# EAGLE design powerSwitch010 (EAGLE 5.12)

## Sheet 1 of 2
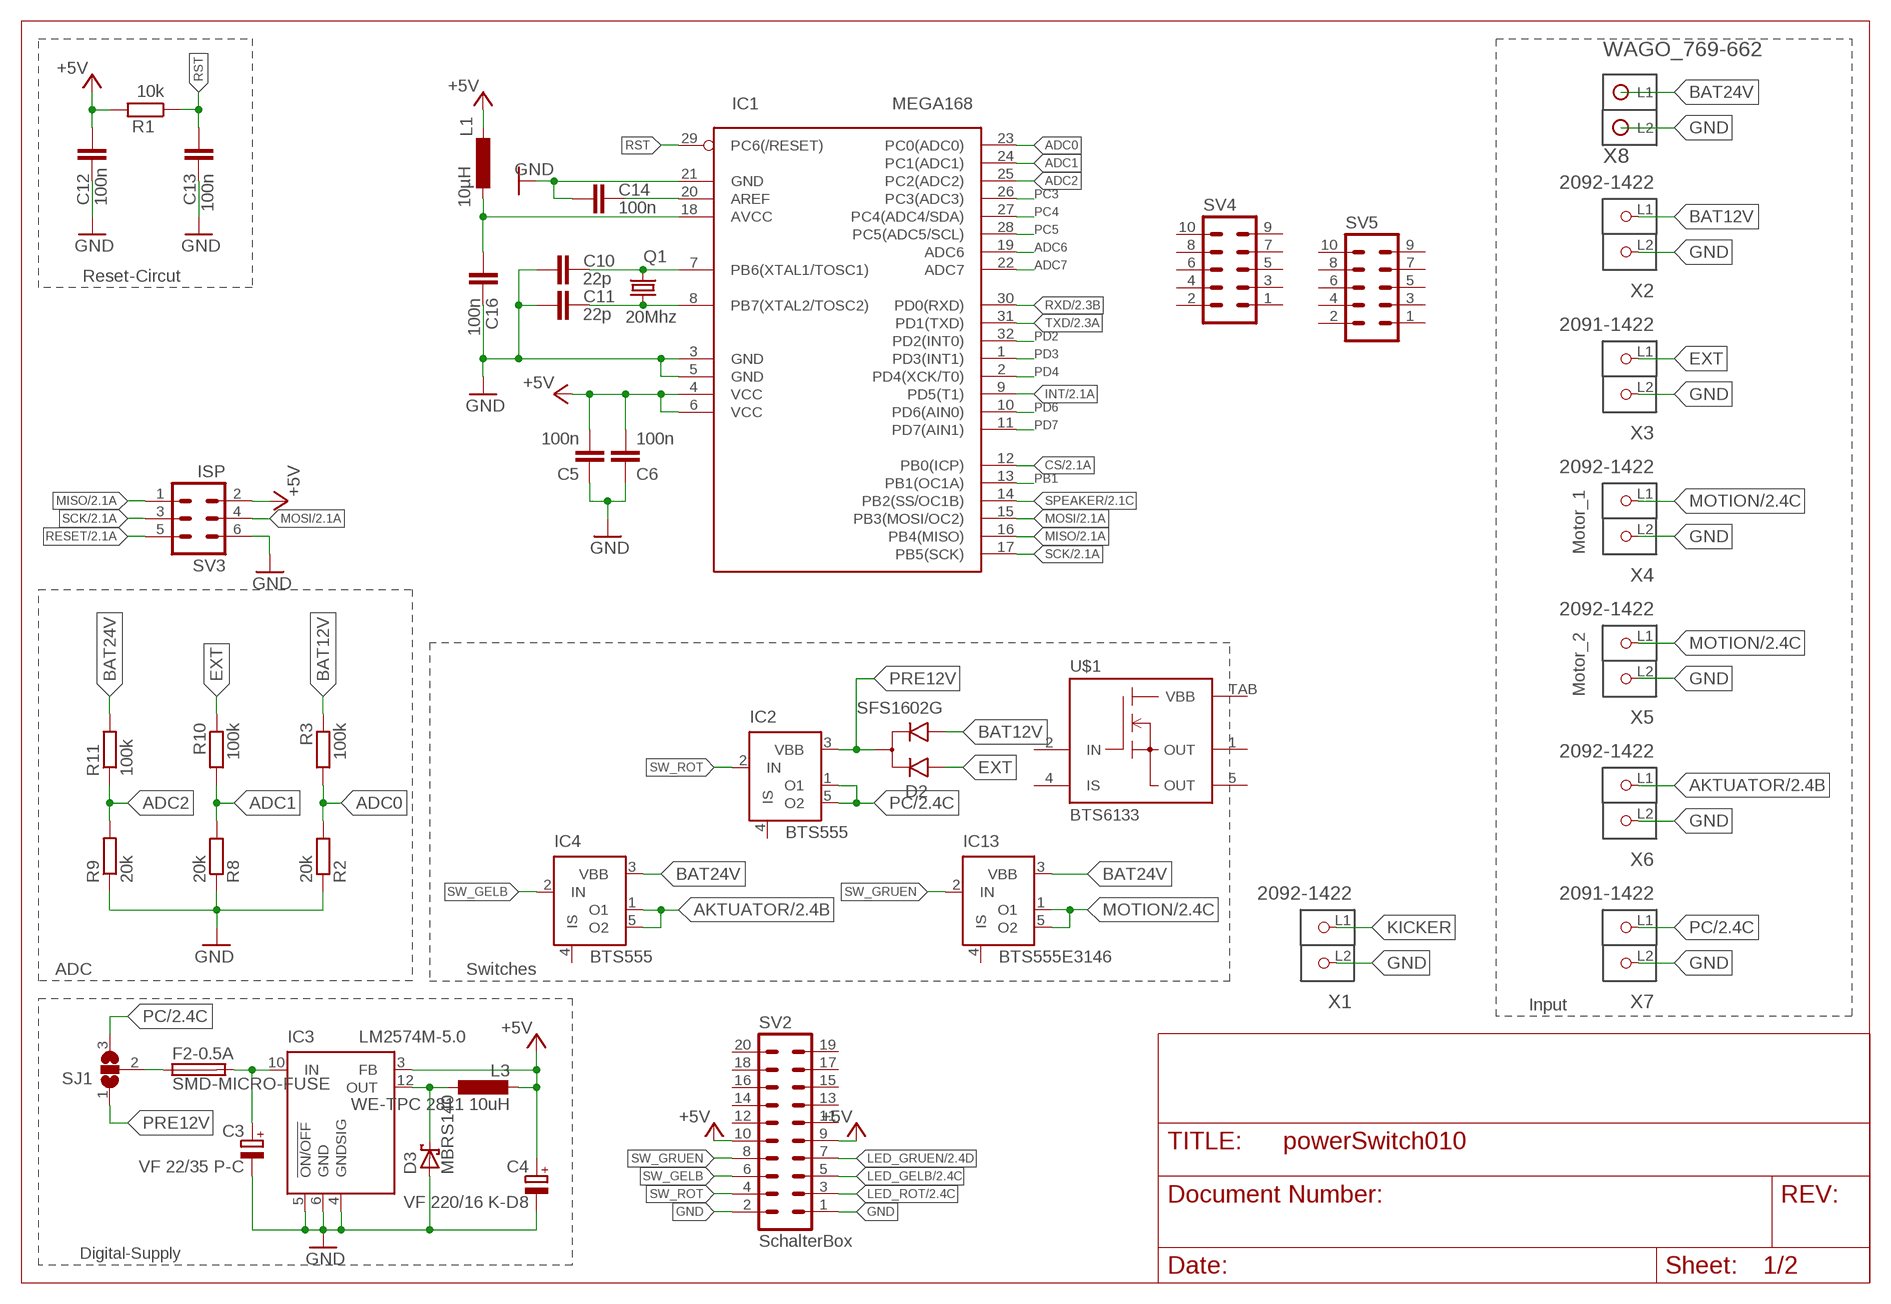
[diagram p0: schematic, sheet 1]

### Parts
C3  VF 22/35 P-C  CPOL-EUC  [PANASONIC_C]
C4  VF 220/16 K-D8  CPOL-EUD  [PANASONIC_D]
C5  100n  C-EUC0603K  [C0603K]
C6  100n  C-EUC0603K  [C0603K]
C10  22p  C-EUC0603K  [C0603K]
C11  22p  C-EUC0603K  [C0603K]
C12  100n  C-EUC0603K  [C0603K]
C13  100n  C-EUC0603K  [C0603K]
C14  100n  C-EUC0603K  [C0603K]
C16  100n  C-EUC0603K  [C0603K]
D2  SFS1602G  SFS160G  [D2PAK]
D3  MBRS140  SCHOTTKY-DIODESMD  [SMB]
F2-0.5A  SMD-MICRO-FUSE  [SMD-6,1X2,6]
IC1  MEGA168  MEGA8-AI  [TQFP32-08]
IC2  BTS555  [TO220-51]
IC3  LM2574M-5.0  [SO14W]
IC4  BTS555  [TO220-51]
IC13  BTS555E3146  [TO220-52]
L1  10µH  L-EU-0805L0805  [R0805]
L3  WE-TPC 2811 10uH  L-EUWE-TPC  [POWER-CHOKE_WE-TPC]
Q1  20Mhz  CRYTALHC49U-V  [HC49U-V@1]
R1  10k  R-EU_R0805  [R0805]
R2  20k  R-EU_R0805  [R0805]
R3  100k  R-EU_R0805  [R0805]
R8  20k  R-EU_R0805  [R0805]
R9  20k  R-EU_R0805  [R0805]
R10  100k  R-EU_R0805  [R0805]
R11  100k  R-EU_R0805  [R0805]
SJ1  SJ2W  [SJ_2]
SV2  SchalterBox  ML20  [ML20]
SV3  ISP  ML6  [ML6]
SV4  ML10  [ML10]
SV5  ML10  [ML10]
U$1  BTS6133  [TO252-51]
X1  2092-1422  [P-2092-1422]
X2  2092-1422  [P-2092-1422]
X3  2091-1422  [P-2091-1422]
X4  2092-1422  [P-2092-1422]
X5  2092-1422  [P-2092-1422]
X6  2092-1422  [P-2092-1422]
X7  2091-1422  [P-2091-1422]
X8  WAGO_769-662  [WAGO_769-662]

### Nets
+5V: C4.+ C5.2 C6.2 C12.2 IC1.4(VCC) IC1.6(VCC) IC3.3(FB) L1.2 L3.2 R1.2 SV2.9 SV2.10 SV3.2 ; also sheet 2
ADC0: IC1.23(PC0(ADC0)) R2.2 R3.2
ADC1: IC1.24(PC1(ADC1)) R8.2 R10.2
ADC2: IC1.25(PC2(ADC2)) R9.2 R11.1
ADC6: IC1.19(ADC6)
ADC7: IC1.22(ADC7)
AKTUATOR: IC4.1(O1) IC4.5(O2) X6.L1(P1) ; also sheet 2
BAT12V: D2.P$2 R3.1 X2.L1(P1)
BAT24V: IC4.3(VBB) IC13.3(VBB) R11.2 X8.P$1(L1)
CS: IC1.12(PB0(ICP)) ; also sheet 2
EXT: D2.P$1 R10.1 X3.L1(P1)
GND: C3.- C4.- C5.1 C6.1 C10.1 C11.1 C12.1 C13.1 C14.1 C16.2 D3.A IC1.3(GND) IC1.5(GND) IC1.21(GND) IC3.4(GNDSIG) IC3.5(!ON/OFF) IC3.6(GND) R2.1 R8.1 R9.1 SV2.1 SV2.2 SV3.6 X1.L2(P2) X2.L2(P2) X3.L2(P2) X4.L2(P2) X5.L2(P2) X6.L2(P2) X7.L2(P2) X8.P$2(L2) ; also sheet 2
INT: IC1.9(PD5(T1)) ; also sheet 2
KICKER: X1.L1(P1)
LED_GELB: SV2.5 ; also sheet 2
LED_GRUEN: SV2.7 ; also sheet 2
LED_ROT: SV2.3 ; also sheet 2
MISO: IC1.16(PB4(MISO)) SV3.1 ; also sheet 2
MOSI: IC1.15(PB3(MOSI/OC2)) SV3.4 ; also sheet 2
MOTION: IC13.1(O1) IC13.5(O2) X4.L1(P1) X5.L1(P1) ; also sheet 2
N$10: C10.2 IC1.7(PB6(XTAL1/TOSC1)) Q1.2
N$11: C11.2 IC1.8(PB7(XTAL2/TOSC2)) Q1.1
N$13: C14.2 IC1.20(AREF)
N$14: C16.1 IC1.18(AVCC) L1.1
N$22: C3.+ F2-0.5A.2 IC3.10(IN)
N$63: F2-0.5A.1 SJ1.2
N$64: D3.C IC3.12(OUT) L3.1
PB1: IC1.13(PB1(OC1A))
PC: IC2.1(O1) IC2.5(O2) SJ1.3 X7.L1(P1) ; also sheet 2
PC3: IC1.26(PC3(ADC3))
PC4: IC1.27(PC4(ADC4/SDA))
PC5: IC1.28(PC5(ADC5/SCL))
PD2: IC1.32(PD2(INT0))
PD3: IC1.1(PD3(INT1))
PD4: IC1.2(PD4(XCK/T0))
PD6: IC1.10(PD6(AIN0))
PD7: IC1.11(PD7(AIN1))
PRE12V: D2.P$3 IC2.3(VBB) SJ1.1
RESET: SV3.5 ; also sheet 2
RST: C13.2 IC1.29(PC6(/RESET)) R1.1
RXD: IC1.30(PD0(RXD)) ; also sheet 2
SCK: IC1.17(PB5(SCK)) SV3.3 ; also sheet 2
SPEAKER: IC1.14(PB2(SS/OC1B)) ; also sheet 2
SW_GELB: IC4.2(IN) SV2.6
SW_GRUEN: IC13.2(IN) SV2.8
SW_ROT: IC2.2(IN) SV2.4
TXD: IC1.31(PD1(TXD)) ; also sheet 2
Unconnected: IC2.4(IS) IC4.4(IS) IC13.4(IS) SV2.11 SV2.12 SV2.13 SV2.14 SV2.15 SV2.16 SV2.17 SV2.18 SV2.19 SV2.20 SV4.1 SV4.2 SV4.3 SV4.4 SV4.5 SV4.6 SV4.7 SV4.8 SV4.9 SV4.10 SV5.1 SV5.2 SV5.3 SV5.4 SV5.5 SV5.6 SV5.7 SV5.8 SV5.9 SV5.10 U$1.1(OUT) U$1.2(IN) U$1.4(IS) U$1.5(OUT)

### Notes on the sheet
- Reset-Circut
- Motor_1
- Motor_2
- ADC | Switches
- Input
- Digital-Supply

## Sheet 2 of 2
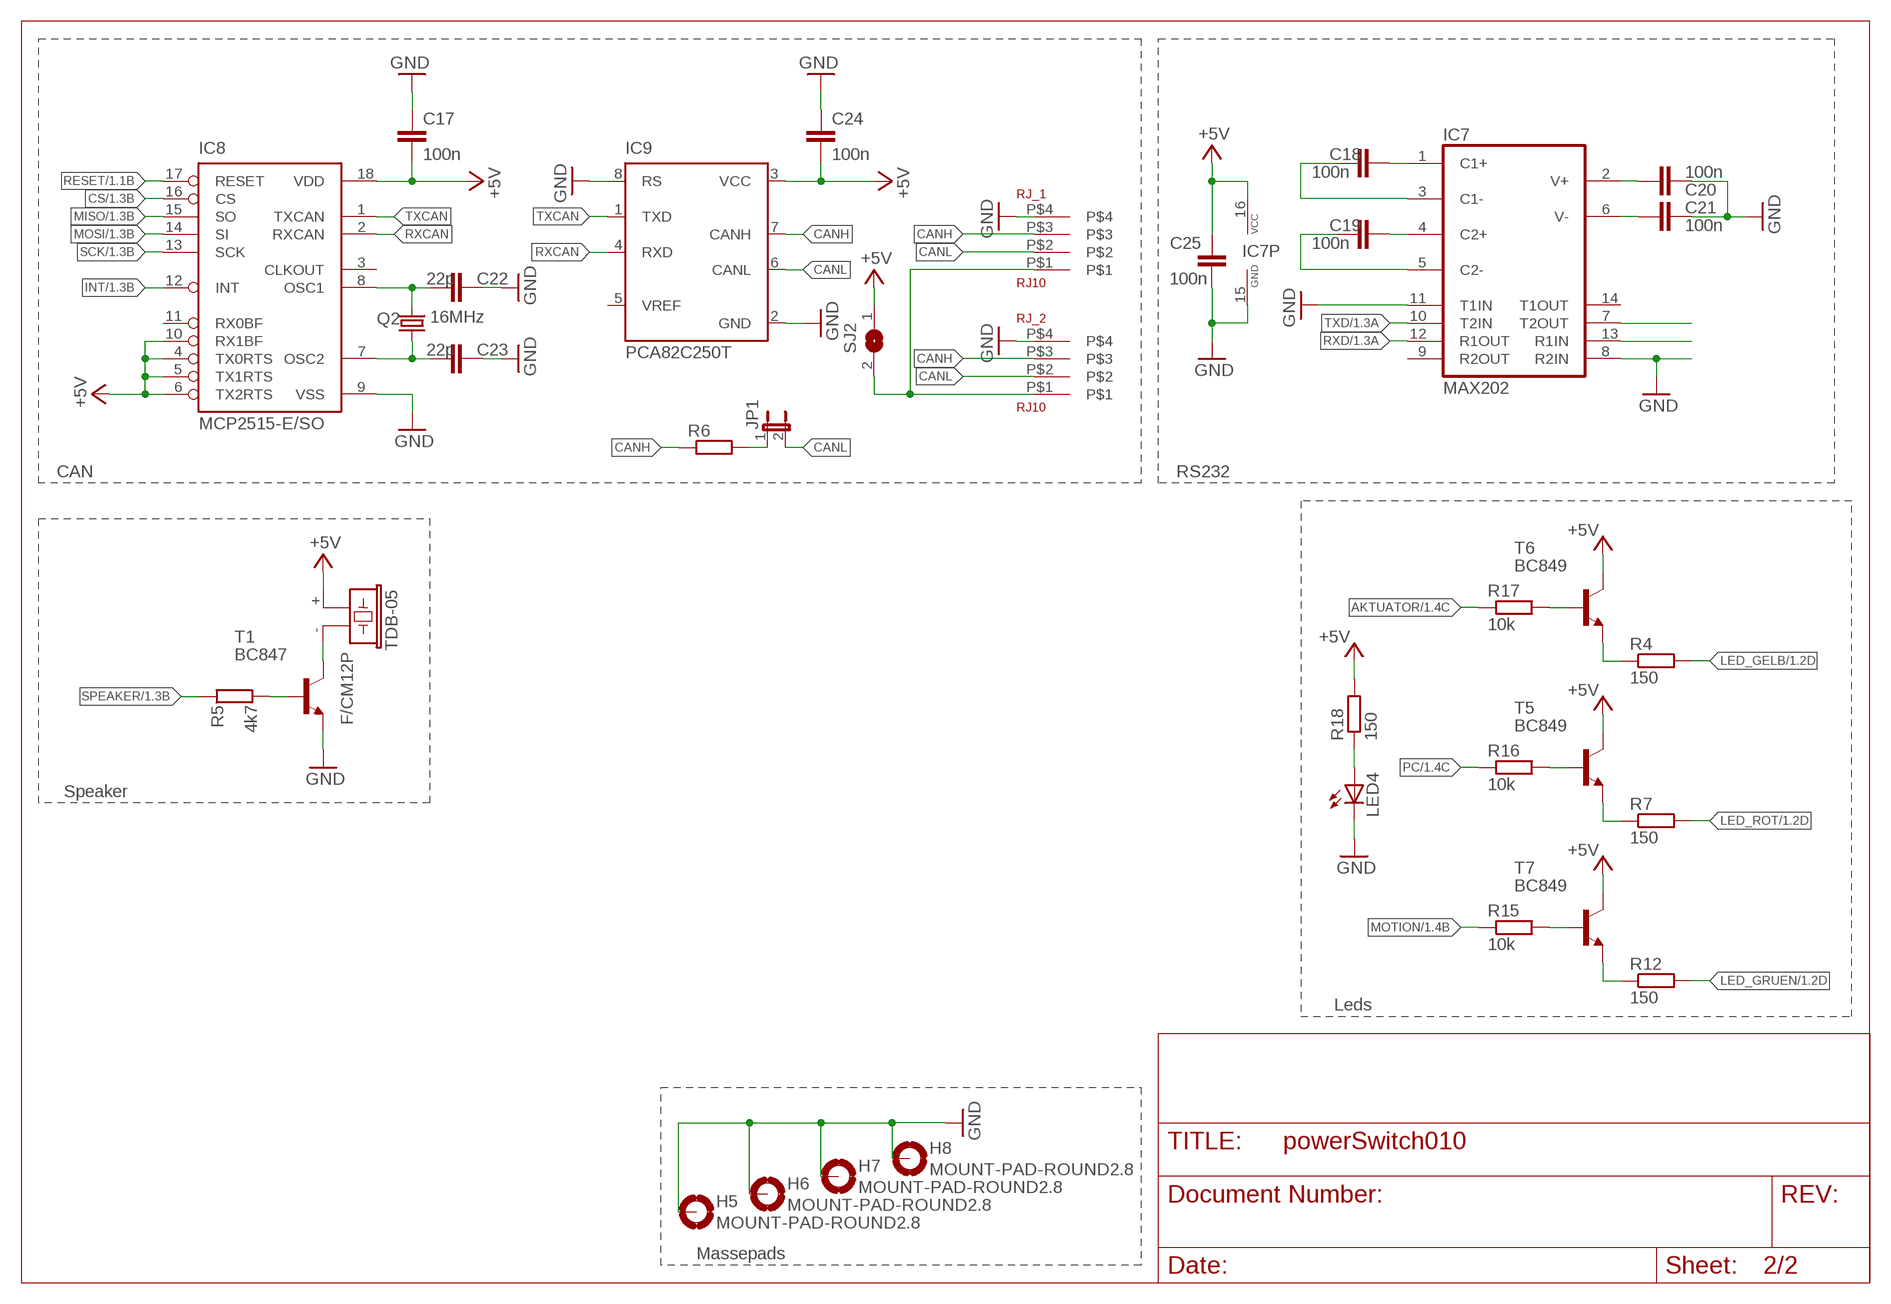
[diagram p1: schematic, sheet 2]

### Parts
C17  100n  C-EUC0603  [C0603]
C18  100n  C-EUC0603K  [C0603K]
C19  100n  C-EUC0603K  [C0603K]
C20  100n  C-EUC0603K  [C0603K]
C21  100n  C-EUC0603K  [C0603K]
C22  22p  C-EUC0603  [C0603]
C23  22p  C-EUC0603  [C0603]
C24  100n  C-EUC0603  [C0603]
C25  100n  C-EUC0603K  [C0603K]
H5  MOUNT-PAD-ROUND2.8  [2,8-PAD]
H6  MOUNT-PAD-ROUND2.8  [2,8-PAD]
H7  MOUNT-PAD-ROUND2.8  [2,8-PAD]
H8  MOUNT-PAD-ROUND2.8  [2,8-PAD]
IC7  MAX202  MAX3232CSE  [SO16]
IC8  MCP2515-E/SO  [SO18L]
IC9  PCA82C250T  [SO8]
JP1  JP1E  [JP1]
LED4  LEDCHIPLED_0805  [CHIPLED_0805]
Q2  16MHz  CRYSTALHC49U-V  [HC49U-V]
R4  150  R-EU_R0805  [R0805]
R5  4k7  R-EU_R0805  [R0805]
R6  R-EU_M0805  [M0805]
R7  150  R-EU_R0805  [R0805]
R12  150  R-EU_R0805  [R0805]
R15  10k  R-EU_R0805  [R0805]
R16  10k  R-EU_R0805  [R0805]
R17  10k  R-EU_R0805  [R0805]
R18  150  R-EU_R0805  [R0805]
RJ_1  RJ10  [RJ10]
RJ_2  RJ10  [RJ10]
SJ2  SJ  [SJ]
T1  BC847  [SOT23]
T5  BC849  [SOT23]
T6  BC849  [SOT23]
T7  BC849  [SOT23]
TDB-05  F/CM12P  [F/CM12P]

### Nets
+5V: C17.2 C24.2 C25.1 IC7.16(VCC) IC8.4(TX0RTS) IC8.5(TX1RTS) IC8.6(TX2RTS) IC8.10(RX1BF) IC8.18(VDD) IC9.3(VCC) R18.2 SJ2.1 T5.3(C) T6.3(C) T7.3(C) TDB-05.+ ; also sheet 1
AKTUATOR: R17.1 ; also sheet 1
CANH: IC9.7(CANH) R6.1 RJ_1.P$3 RJ_2.P$3
CANL: IC9.6(CANL) JP1.2 RJ_1.P$2 RJ_2.P$2
CS: IC8.16(CS) ; also sheet 1
GND: C17.1 C20.2 C21.2 C22.2 C23.2 C24.1 C25.2 H5.B2,8(MOUNT) H6.B2,8(MOUNT) H7.B2,8(MOUNT) H8.B2,8(MOUNT) IC7.8(R2IN) IC7.11(T1IN) IC7.15(GND) IC8.9(VSS) IC9.2(GND) IC9.8(RS) LED4.C RJ_1.P$4 RJ_2.P$4 T1.2(E) ; also sheet 1
INT: IC8.12(INT) ; also sheet 1
LED_GELB: R4.2 ; also sheet 1
LED_GRUEN: R12.2 ; also sheet 1
LED_ROT: R7.2 ; also sheet 1
MISO: IC8.15(SO) ; also sheet 1
MOSI: IC8.14(SI) ; also sheet 1
MOTION: R15.1 ; also sheet 1
N$1: R5.2 T1.1(B)
N$2: RJ_1.P$1 RJ_2.P$1 SJ2.2
N$4: R7.1 T5.2(E)
N$5: R4.1 T6.2(E)
N$6: R12.1 T7.2(E)
N$7: JP1.1 R6.2
N$15: C18.2 IC7.1(C1+)
N$18: C19.2 IC7.4(C2+)
N$20: T1.3(C) TDB-05.-
N$32: C22.1 IC8.8(OSC1) Q2.2
N$34: C23.1 IC8.7(OSC2) Q2.1
N$35: C18.1 IC7.3(C1-)
N$36: C19.1 IC7.5(C2-)
N$37: C20.1 IC7.2(V+)
N$38: C21.1 IC7.6(V-)
N$40: IC7.13(R1IN)
N$41: IC7.7(T2OUT)
N$102: R16.2 T5.1(B)
N$104: R17.2 T6.1(B)
N$106: R15.2 T7.1(B)
N$108: LED4.A R18.1
PC: R16.1 ; also sheet 1
RESET: IC8.17(RESET) ; also sheet 1
RXCAN: IC8.2(RXCAN) IC9.4(RXD)
RXD: IC7.12(R1OUT) ; also sheet 1
SCK: IC8.13(SCK) ; also sheet 1
SPEAKER: R5.1 ; also sheet 1
TXCAN: IC8.1(TXCAN) IC9.1(TXD)
TXD: IC7.10(T2IN) ; also sheet 1
Unconnected: IC7.9(R2OUT) IC7.14(T1OUT) IC8.3(CLKOUT) IC8.11(RX0BF) IC9.5(VREF)

### Notes on the sheet
- CAN | RS232
- Speaker
- Leds
- Massepads

## Power pins joined to a net without a drawn wire
VBB: U$1.TAB(VBB)

## Library data of the parts
C3 C4 = rcl:CPOL-EU: POLARIZED CAPACITOR, European symbol
C5 C6 C10-C14 C16-C25 = rcl:C-EU: CAPACITOR, European symbol
D2 = ownParts:SFS160*G
D3 = diode:SCHOTTKY-DIODE: Schottky Diode
F2-0.5A = f-lf-omniblok-s:SMD-MICRO-FUSE
H5-H8 = holes:MOUNT-PAD-ROUND: MOUNTING PAD, round
IC1 = atmel:MEGA8: MICROCONTROLLER 8 Kbytes FLASH, 1 kbytes SRAM, 512 bytes EEPROM, USART, 6-channel 10 bit ADC, 2-channel 8 bit ADC Pin compatible with Atmega48, ATMega88, ATMega168 Source: avr.lbr; MPN: ATMEGA8-16AU; OC_FARNELL: 9171371; OC_NEWARK: 73M8863
IC2 IC4 = infineon:BTS555: PROFET® Data Sheet BTS555 Source: http://www.infineon.com/upload/Document/cmc_upload/documents/011/8726/Datasheet_BTS555.pdf; MF: FARNELL; MPN: BTS555.; OC_FARNELL: 4109260; OC_NEWARK: 26H6766
IC3 = linear:LM2574?-*: SIMPLE SWITCHER 0.5A Step-Down Voltage Regulator Source: http://cache.national.com/ds/LM/LM2574.pdf
IC7 = maxim:MAX3232*: True RS-232 Transceivers 3.0V to 5.5V, Low-Power up to 1Mbps, Using Four 0.1µF External Capacitors Source: http://pdfserv.maxim-ic.com/en/ds/MAX3222-MAX3241.pdf; MPN: MAX3232CSE; OC_FARNELL: 9725490; OC_NEWARK: 90C2890
IC8 = mcp2515:MCP2515
IC9 = micro-philips:PCA82C250: CAN CONTROLLER INTERFACE; OC_FARNELL: 1085275; OC_NEWARK: unknown
IC13 = infineon:BTS555: PROFET® Data Sheet BTS555 Source: http://www.infineon.com/upload/Document/cmc_upload/documents/011/8726/Datasheet_BTS555.pdf; OC_FARNELL: unknown; OC_NEWARK: unknown
JP1 = jumper:JP1E: JUMPER
L1 = myrcl:L-EU-0805
L3 = rcl:L-EU: INDUCTOR, European symbol
LED4 = led:LED: LED OSRAM: - CHIPLED LG R971, LG N971, LY N971, LG Q971, LY Q971, LO R971, LY R971 LH N974, LH R974 LS Q976, LO Q976, LY Q976 LO Q996 - Hyper CHIPLED LW Q18S LB Q993, LB Q99A, LB R99A - SideLED LS A670, LO A670, LY A670, LG A670, LP A670 LB A673, LV A673, LT A673, LW A673 LH A674 LY A675 LS A676, LA A676, LO A676, LY A676, LW A676 LS A679, LY A679, LG A679 - Hyper Micro SIDELED® LS Y876, LA Y876, LO Y876, LY Y876 LT Y87S - SmartLED LW L88C, LW L88S LB L89C, LB L89S, LG L890 LS L89K, LO L89K, LY L89K LS L896, LA L896, LO L896, LY L896 - TOPLED LS T670, LO T670, LY T670, LG T670, LP T670 LSG T670, LSP T670, LSY T670, LOP T670, LYG T670 LG T671, LOG T671, LSG T671 LB T673, LV T673, LT T673, LW T673 LH T674 LS T676, LA T676, LO T676, LY T676, LB T676, LH T676, LSB T676, LW T676 LB T67C, LV T67C, LT T67C, LS T67K, LO T67K, LY T67K, LW E67C LS E67B, LA E67B, LO E67B, LY E67B, LB E67C, LV E67C, LT E67C LW T67C LS T679, LY T679, LG T679 LS T770, LO T770, LY T770, LG T770, LP T770 LB T773, LV T773, LT T773, LW T773 LH T774 LS E675, LA E675, LY E675, LS T675 LS T776, LA T776, LO T776, LY T776, LB T776 LHGB T686 LT T68C, LB T68C - Hyper Mini TOPLED® LB M676 - Mini TOPLED Santana® LG M470 LS M47K, LO M47K, LY M47K Source: http://www.osram.convergy.de LUXEON: - LUMILED® LXK2-PW12-R00, LXK2-PW12-S00, LXK2-PW14-U00, LXK2-PW14-V00 LXK2-PM12-R00, LXK2-PM12-S00, LXK2-PM14-U00 LXK2-PE12-Q00, LXK2-PE12-R00, LXK2-PE12-S00, LXK2-PE14-T00, LXK2-PE14-U00 LXK2-PB12-K00, LXK2-PB12-L00, LXK2-PB12-M00, LXK2-PB14-N00, LXK2-PB14-P00, LXK2-PB14-Q00 LXK2-PR12-L00, LXK2-PR12-M00, LXK2-PR14-Q00, LXK2-PR14-R00 LXK2-PD12-Q00, LXK2-PD12-R00, LXK2-PD12-S00 LXK2-PH12-R00, LXK2-PH12-S00 LXK2-PL12-P00, LXK2-PL12-Q00, LXK2-PL12-R00 Source: www.luxeon.com KINGBRIGHT: KA-3528ASYC Source: www.kingbright.com
Q1 = crystal:CRYTAL: CRYSTAL
Q2 = crystal:CRYSTAL: CRYSTAL; OC_FARNELL: 1666969; OC_NEWARK: unknown
R1-R12 R15-R18 = rcl:R-EU_: RESISTOR, European symbol
RJ_1 RJ_2 = ownParts:RJ10
SJ1 = jumper:SJ2W: SMD solder JUMPER
SJ2 = jumper:SJ: SMD solder JUMPER
SV2 = con-ml:ML20: HARTING; OC_FARNELL: unknown; OC_NEWARK: unknown
SV3 = con-ml:ML6: HARTING; OC_FARNELL: unknown; OC_NEWARK: unknown
SV4 SV5 = con-ml:ML10: HARTING; OC_FARNELL: unknown; OC_NEWARK: unknown
T1 = transistor:BC847: NPN TRANSISTOR
T5-T7 = transistor:BC849: NPN TRANSISTOR
TDB-05 = buzzer:F/CM12P: BUZZER Source: Buerklin; OC_FARNELL: unknown; OC_NEWARK: unknown
U$1 = BTS443P:BTS6133
X1 X2 X4-X6 = con-wago_5.0 mm:2092-1422: Serie 2092, Stiftleiste mit abgewinkelten Lötstiften 2-polig / Series 2092, Male header with angled solder pins 2-pole Polzahl / Pole No.: 2 Rastermaß / Pitch: 5 mm Bemessungsspannung / Rated Voltage: 320 V Nennstrom / Nominal Current: 16 A Lötstiftlänge: / Solder Pin Length: 3.6 mm Farbe / Color: lichtgrau / light gray Stand: 01.01.2013. Die jeweils aktuellen Daten zu diesem Artikel finden Sie in unserem Produktkatalog, den Sie unter www.wago.com einsehen können. As of: 01/01/2013. Please find the newest data for this article in our product catalogue, which can be viewed under www.wago.com.
X3 X7 = con-wago_3.5 mm:2091-1422: Serie 2091, Stiftleiste mit abgewinkelten Lötstiften 2-polig / Series 2091, Male header with angled solder pins 2-pole Polzahl / Pole No.: 2 Rastermaß / Pitch: 3.5 mm Bemessungsspannung / Rated Voltage: 160 V Nennstrom / Nominal Current: 10 A Lötstiftlänge: / Solder Pin Length: 3.6 mm Farbe / Color: lichtgrau / light gray Stand: 01.01.2013. Die jeweils aktuellen Daten zu diesem Artikel finden Sie in unserem Produktkatalog, den Sie unter www.wago.com einsehen können. As of: 01/01/2013. Please find the newest data for this article in our product catalogue, which can be viewed under www.wago.com.
X8 = ownParts:WAGO_769-662

## Board
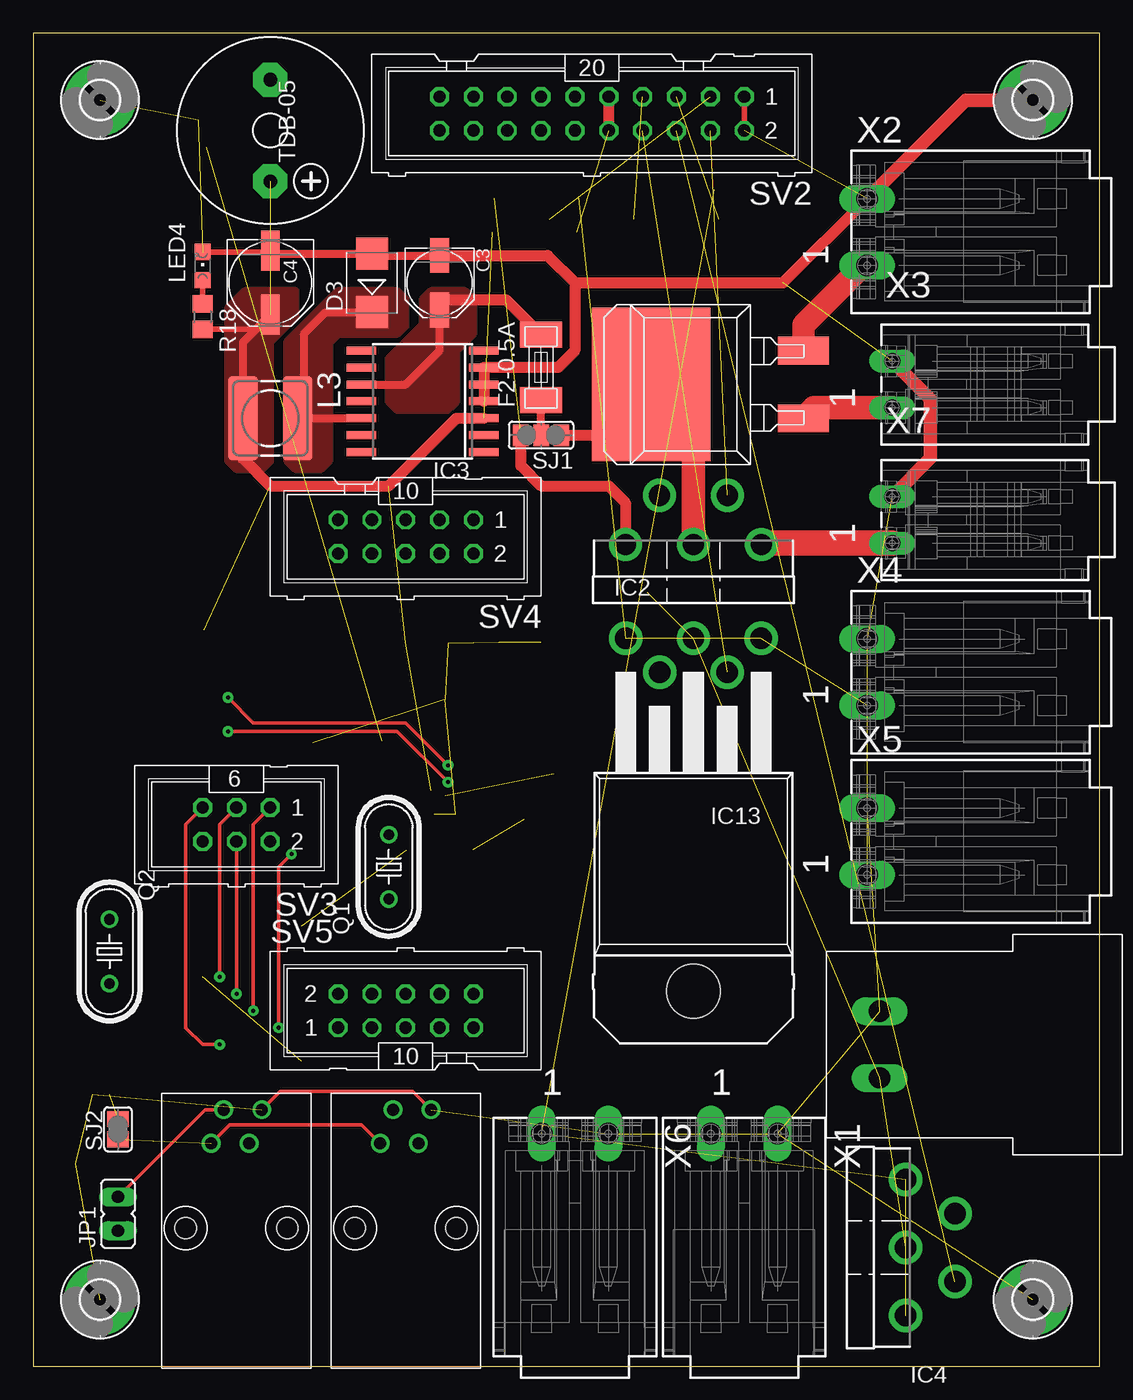
[diagram p2: board, top side]
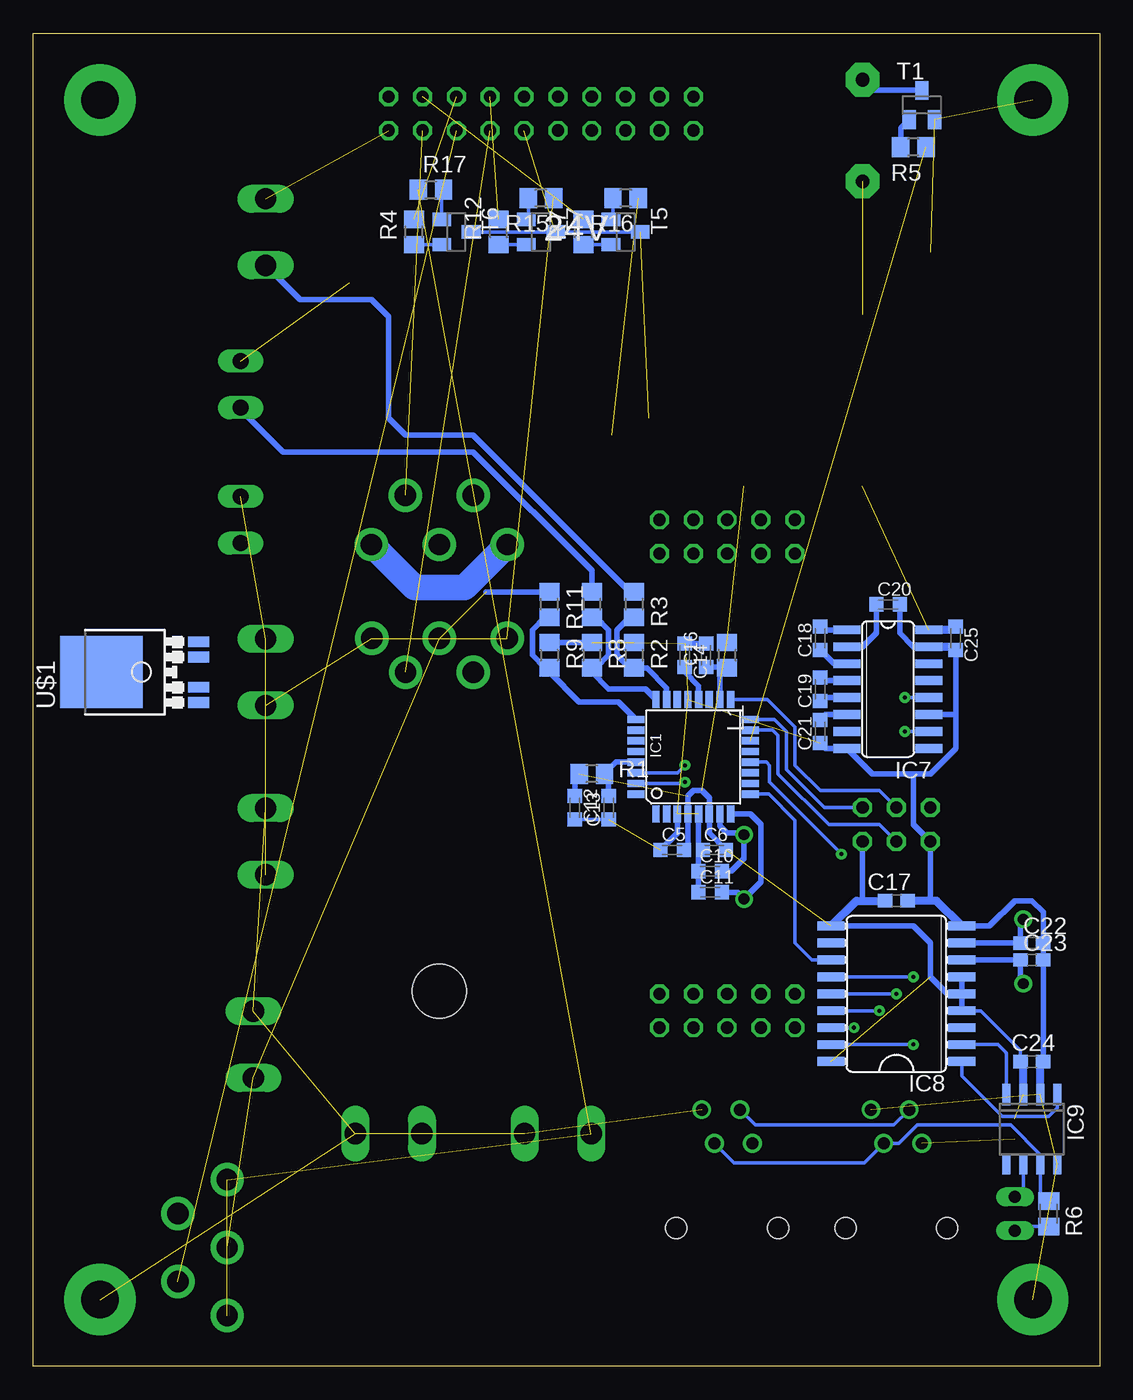
[diagram p3: board, bottom side, seen from below]

Size 80 x 100 mm. Coordinates in mm from the lower left corner, seen from the top.
Outline: 0,0 80,0 80,100 0,100 0,0
Copper layers (1*16): Top 0.105mm / dielectric 1.5mm / Bottom 0.105mm
Design rules "multi-cb_105um-cu *": minimum track width 10mil, minimum drill 12mil, track to track 10mil, track to pad 10mil, pad to pad 10mil, via to via 10mil, smd to smd 10mil, copper to edge 20mil, drill to drill 12mil, minimum pad ring 10mil, minimum via ring 10mil, stop-mask expansion 3mil, vias tented up to drill 0mil, thermal gap 10mil

### Footprints (pad centres in the part's own frame; a part is rotated, then mirrored left to right if it is on the bottom)
PANASONIC_C = smd 2.6 x 1.4: + 2.05,0; - -2.05,0
PANASONIC_D = smd 3 x 1.4: + 2.4,0; - -2.4,0
C0603K = smd 1.05 x 1.08: 1 -0.875,0; 2 0.875,0
C0603 = smd 1.1 x 1: 1 -0.85,0; 2 0.85,0
D2PAK = smd 2.08 x 3.81: P$1 -2.54,-6.985; P$2 2.54,-6.985 | smd 11.5 x 8.89: P$3 0,4.445
SMB = smd 2.4 x 2.4: A 2.2,0; C -2.2,0
SMD-6,1X2,6 = smd 1.96 x 3.15: 1 -2.45,0; 2 2.45,0
2,8-PAD = drill 2.8 pad 5.334 round: B2,8 0,0
TQFP32-08 = smd 1.27 x 0.559: 1 -4.293,2.8; 2 -4.293,2; 3 -4.293,1.2; 4 -4.293,0.4; 5 -4.293,-0.4; 6 -4.293,-1.2; 7 -4.293,-2; 8 -4.293,-2.8; 17 4.293,-2.8; 18 4.293,-2; 19 4.293,-1.2; 20 4.293,-0.4; 21 4.293,0.4; 22 4.293,1.2; 23 4.293,2; 24 4.293,2.8 | smd 0.559 x 1.27: 9 -2.8,-4.293; 10 -2,-4.293; 11 -1.2,-4.293; 12 -0.4,-4.293; 13 0.4,-4.293; 14 1.2,-4.293; 15 2,-4.293; 16 2.8,-4.293; 25 2.8,4.293; 26 2,4.293; 27 1.2,4.293; 28 0.4,4.293; 29 -0.4,4.293; 30 -1.2,4.293; 31 -2,4.293; 32 -2.8,4.293
TO220-51 = drill 1.6 pad 2.5 round: 1 -5.1,-4.5; 2 -2.55,-8.2; 3 0,-4.5; 4 2.55,-8.2; 5 5.1,-4.5
SO14W = smd 0.6 x 2.2: 1 -3.81,-4.6; 2 -2.54,-4.6; 3 -1.27,-4.6; 4 0,-4.6; 5 1.27,-4.6; 6 2.54,-4.6; 7 3.81,-4.6; 8 3.81,4.6; 9 2.54,4.6; 10 1.27,4.6; 11 0,4.6; 12 -1.27,4.6; 13 -2.54,4.6; 14 -3.81,4.6
SO16 = smd 0.66 x 2.032: 1 -4.445,-3.073; 2 -3.175,-3.073; 3 -1.905,-3.073; 4 -0.635,-3.073; 5 0.635,-3.073; 6 1.905,-3.073; 7 3.175,-3.073; 8 4.445,-3.073; 9 4.445,3.073; 10 3.175,3.073; 11 1.905,3.073; 12 0.635,3.073; 13 -0.635,3.073; 14 -1.905,3.073; 15 -3.175,3.073; 16 -4.445,3.073
SO18L = smd 0.66 x 2.032: 1 -5.08,-4.902; 2 -3.81,-4.902; 3 -2.54,-4.902; 4 -1.27,-4.902; 5 0,-4.902; 6 1.27,-4.902; 7 2.54,-4.902; 8 3.81,-4.902; 9 5.08,-4.902; 10 5.08,4.902; 11 3.81,4.902; 12 2.54,4.902; 13 1.27,4.902; 14 0,4.902; 15 -1.27,4.902; 16 -2.54,4.902; 17 -3.81,4.902; 18 -5.08,4.902
SO8 = smd 0.6 x 1.6: 1 -1.905,-2.6; 2 -0.635,-2.6; 3 0.635,-2.6; 4 1.905,-2.6; 5 1.905,2.6; 6 0.635,2.6; 7 -0.635,2.6; 8 -1.905,2.6
TO220-52 = drill 1.6 pad 2.5 round: 1 -5.08,-30.48; 2 -2.54,-27.94; 3 0,-30.48; 4 2.54,-27.94; 5 5.08,-30.48 | hole 4.05: 0,-4
JP1 = drill 0.914 long: 1 0,-1.27; 2 0,1.27
R0805 = smd 1.3 x 1.5: 1 -0.95,0; 2 0.95,0
POWER-CHOKE_WE-TPC = smd 6.3 x 2.2: 1 0,2.05; 2 0,-2.05
CHIPLED_0805 = smd 1.2 x 1.2: A 0,-1.05; C 0,1.05
HC49U-V@1 = drill 0.813 round: 1 -2.413,0; 2 2.413,0
HC49U-V = drill 0.813 round: 1 -2.413,0; 2 2.413,0
M0805 = smd 1.3 x 1.6: 1 -0.95,0; 2 0.95,0
RJ10 = drill 0.9 round: P$1 -1.905,6.55; P$2 -0.953,9.09; P$3 0.953,6.55; P$4 1.905,9.09 | hole 1.59: -3.81,0.2; 3.81,0.2
SJ_2 = smd 1.168 x 1.6: 1 -1.524,0; 2 0,0; 3 1.524,0
SJ = smd 1.168 x 1.6: 1 -0.762,0; 2 0.762,0
ML20 = drill 0.914 octagon: 1 -11.43,-1.27; 2 -11.43,1.27; 3 -8.89,-1.27; 4 -8.89,1.27; 5 -6.35,-1.27; 6 -6.35,1.27; 7 -3.81,-1.27; 8 -3.81,1.27; 9 -1.27,-1.27; 10 -1.27,1.27; 11 1.27,-1.27; 12 1.27,1.27; 13 3.81,-1.27; 14 3.81,1.27; 15 6.35,-1.27; 16 6.35,1.27; 17 8.89,-1.27; 18 8.89,1.27; 19 11.43,-1.27; 20 11.43,1.27
ML6 = drill 0.914 octagon: 1 -2.54,-1.27; 2 -2.54,1.27; 3 0,-1.27; 4 0,1.27; 5 2.54,-1.27; 6 2.54,1.27
ML10 = drill 0.914 octagon: 1 -5.08,-1.27; 2 -5.08,1.27; 3 -2.54,-1.27; 4 -2.54,1.27; 5 0,-1.27; 6 0,1.27; 7 2.54,-1.27; 8 2.54,1.27; 9 5.08,-1.27; 10 5.08,1.27
SOT23 = smd 1 x 1.4: 1 -0.95,-1.1; 2 0.95,-1.1; 3 0,1.1
F/CM12P = drill 1.016 pad 2.54 octagon: + 3.81,0; - -3.81,0
TO252-51 = smd 0.8 x 1.6: 1 -2.28,-4.8; 2 -1.14,-4.8; 4 1.14,-4.8; 5 2.28,-4.8 | smd 5.4 x 6.2: TAB 0,2.5
P-2092-1422 = drill 1.6 pad 2 long: L1 -8.55,-2.5; L2 -8.55,2.5
P-2091-1422 = drill 1.2 long: L1 -7.95,-1.75; L2 -7.95,1.75
WAGO_769-662 = drill 1.6 long: P$1 0,-2.5; P$2 0,2.5

### Placement (x,y rotation side)
C3  30.48,81.28 270 top
C4  17.78,81.28 270 top
C5  32.07,38.73 0 bottom
C6  28.89,38.73 0 bottom
C10  29.21,37.15 0 bottom
C11  29.21,35.56 0 bottom
C12  39.37,41.91 90 bottom
C13  36.83,41.91 90 bottom
C14  31.11,53.34 270 bottom
C16  29.53,53.34 90 bottom
C17  15.24,34.92 180 bottom
C18  20.95,54.61 90 bottom
C19  20.95,50.8 90 bottom
C20  15.88,57.15 0 bottom
C21  20.95,47.62 270 bottom
C22  5.08,31.75 0 bottom
C23  5.08,30.48 0 bottom
C24  5.08,22.86 180 bottom
C25  10.79,54.61 270 bottom
D2  50.8,73.66 90 top
D3  25.4,81.28 90 top
F2-0.5A  38.1,74.93 90 top
H5  5,95 0 top
H6  75,95 0 top
H7  5,5 0 top
H8  75,5 0 top
IC1  30.48,45.72 90 bottom
IC2  49.53,57.15 180 top
IC3  29.21,72.39 90 top
IC4  60.96,8.89 90 top
IC7  15.88,50.8 270 bottom
IC8  15.24,27.94 90 bottom
IC9  5.08,17.78 180 bottom
IC13  49.53,24.13 180 top
JP1  6.35,11.43 0 top
L1  27.94,53.34 90 bottom
L3  17.78,71.12 270 top
LED4  12.7,82.55 0 top
Q1  26.67,37.47 90 top
Q2  5.71,31.11 90 top
R1  38.1,44.45 180 bottom
R2  34.92,53.34 270 bottom
R3  34.92,57.15 270 bottom
R4  51.44,85.09 90 bottom
R5  13.97,91.44 180 bottom
R6  3.81,11.43 270 bottom
R7  38.73,85.09 90 bottom
R8  38.1,53.34 270 bottom
R9  41.27,53.34 270 bottom
R10  38.1,57.15 270 bottom
R11  41.27,57.15 90 bottom
R12  45.09,85.09 90 bottom
R15  41.91,87.63 180 bottom
R16  35.56,87.63 180 bottom
R17  50.16,88.27 0 bottom
R18  12.7,78.74 270 top
RJ_1  27.94,10.16 0 top
RJ_2  15.24,10.16 0 top
SJ1  38.1,69.85 180 top
SJ2  6.35,17.78 270 top
SV2  41.91,93.98 180 top
SV3  15.24,40.64 180 top
SV4  27.94,62.23 180 top
SV5  27.94,26.67 0 top
T1  13.34,94.61 0 bottom
T5  35.56,85.09 270 bottom
T6  48.26,85.09 270 bottom
T7  41.91,85.09 270 bottom
TDB-05  17.78,92.71 270 top
U$1  72.39,52.07 90 bottom
X1  53.34,8.89 270 top
X2  71.12,85.09 0 top
X3  72.39,73.66 0 top
X4  71.12,52.07 0 top
X5  71.12,39.37 0 top
X6  40.64,8.89 270 top
X7  72.39,63.5 0 top
X8  63.5,24.13 0 top

### Tracks (layer width: path | path; a pad name or v marks a point on that pad's centre or on a via)
+5V  (10 unrouted)
  Top 0.406: R18.2 16.19,77.79 16.44,77.54
  Top 0.61: C4.+ 16.44,77.54 15.73,76.83 L3.2
  Top 0.813: SV2.10 SV2.9 | IC3.3 31.75,71.12 26.67,66.04 17.78,66.04 15.73,68.09 L3.2
  Bottom 0.254: 5.71,22.64 C24.2 5.93,23.71 8.89,26.67 IC8.4 | T5.3 T7.3 T6.3
  Bottom 0.406: C5.2 30.88,39.05 IC1.4 30.88,42.78 30.48,43.18 29.84,43.18 29.28,42.62 IC1.6 29.28,40 C6.2 | IC8.5 IC8.6 | IC8.4 IC8.5 | IC8.10 13.97,33.02 12.7,31.75 12.7,29.21 11.43,27.94 IC8.5 | R1.2 39.37,44.13 C12.2 | 17.78,34.92 SV3.2
  Bottom 0.61: IC8.10 18.24,34.92 17.78,34.92 C17.2 | IC9.3 5.71,22.64 | C25.1 11.04,55.24 IC7.16
  pour Top (rank 2, no thermals): 19.68,80.64 15.88,80.64 14.61,79.38 14.61,67.94 15.24,67.31 17.14,67.31 17.78,67.94 17.78,76.83 19.68,78.74
ADC0
  Bottom 0.406: R3.2 35.24,56.2 36.2,55.24 36.2,53.34 35.24,52.39 R2.2 33.98,52.39 32.48,50.9 IC1.23
ADC1
  Bottom 0.406: R8.2 37.78,52.39 36.83,53.34 36.83,55.24 37.78,56.2 R10.2 | R8.2 38.42,52.07 | IC1.24 34.07,50.8 36.83,50.8 38.1,52.07 R8.2
ADC2
  Bottom 0.406: R11.1 41.59,56.2 42.55,55.24 42.55,53.34 41.59,52.39 R9.2 41.27,52.07 39.05,49.85 36.1,49.85 IC1.25
AKTUATOR  (3 unrouted)
BAT12V
  Top 1.676: X2.L1 62.27,82.59 57.78,78.11 D2.P$2
  Bottom 0.406: X2.L1 59.99,80.01 54.61,80.01 53.34,78.74 53.34,71.12 52.07,69.85 46.99,69.85 34.92,57.78 R3.1
BAT24V  (3 unrouted)
  Bottom 0.406: R11.2 46.04,58.1
CANH
  Bottom 0.254: RJ_1.P$3 27.42,15.24 17.66,15.24 RJ_2.P$3 15.04,16.71 13.65,18.1 6.67,18.1 4.45,15.88 IC9.7 4.45,13.02 R6.1
CANL
  Top 0.254: RJ_2.P$2 12.9,19.25 JP1.2
  Bottom 0.254: RJ_2.P$2 15.44,18.1 25.84,18.1 RJ_1.P$2 | IC9.6 5.71,13.34 JP1.2
CS  (via drill 0.3)
  Top 0.254: v19.37,38.42 18.41,37.47 v18.41,25.4
  Bottom 0.254: IC1.12 25,45.32 24.77,45.09 24.77,43.81 v19.37,38.42 | IC8.16 v18.41,25.4
EXT
  Top 1.778: D2.P$1 58.58,71.91 X3.L1
  Bottom 0.406: R10.1 38.1,59.69 46.99,68.58 61.26,68.58 64.44,71.76 X3.L1
GND  (21 unrouted)
  Top 0.254: RJ_2.P$4 18.53,20.64 28.46,20.64 RJ_1.P$4
  Top 0.406: SV2.2 SV2.1 | LED4.C 17.7,83.6 C4.-
  Top 0.61: 25.4,83.33 C3.- | 17.78,83.48 D3.A
  Top 0.813: IC3.4 IC3.5 IC3.6 39.37,74.93 40.64,76.2 40.64,81.28 | 40.64,81.28 38.59,83.33 C3.- | X2.L2 56.26,81.28 40.64,81.28
  Top 1.016: H6.B2,8 69.98,95 X2.L2 | X7.L2 67.31,68.12 67.31,72.54 X3.L2
  Top 1.422: D3.A 25.4,83.33 | C4.- 17.78,83.48
  Bottom 0.254: C13.1 C12.1 | 30.09,38.42 C6.1 | 4.45,22.64 C24.1
  Bottom 0.406: C6.1 30.08,39.05 IC1.5 | C5.1 31.68,40 IC1.3 | 30.09,38.42 C10.1 C11.1 | C16.2 C14.1 | C21.2 20.56,46.35 IC7.8 17.04,44.45 13.97,44.45 | C20.2 15,55.01 13.97,53.98 IC7.15 | IC8.9 8.26,33.02 6.35,34.92 5.08,34.92 4.23,34.08 C22.2 C23.2 C24.1 | R8.1 R9.1 | 12.7,34.92 SV3.6 13.97,40.64 13.97,44.45 | 10.79,48.9 10.79,46.35 12.7,44.45 13.97,44.45 | 10.79,48.9 IC7.11 | 10.79,48.9 C25.2
  Bottom 0.61: C17.1 12.7,34.92 12.24,34.92 IC8.9 | IC9.2 4.45,22.64 | IC7.15 11.04,53.98 C25.2
INT
  Bottom 0.254: IC1.9 24.82,42.92 22.86,40.96 22.86,31.75 21.59,30.48 IC8.12
LED_GELB  (1 unrouted)
LED_GRUEN  (1 unrouted)
LED_ROT  (1 unrouted)
MISO  (via drill 0.3)
  Top 0.254: v16.51,26.67 16.51,40.64 SV3.1
  Bottom 0.254: IC1.16 24.39,48.52 23.5,47.62 23.5,44.77 20.64,41.91 SV3.1 | IC8.15 v16.51,26.67
MOSI  (via drill 0.3)
  Top 0.254: v15.24,27.94 SV3.4
  Bottom 0.254: IC1.15 24.54,47.72 24.13,47.31 24.13,44.45 20.32,40.64 16.51,40.64 SV3.4 | v15.24,27.94 IC8.14
MOTION  (4 unrouted)
N$1
  Bottom 0.406: T1.1 14.92,92.88 R5.2
N$2  (1 unrouted)
  Top 0.254: RJ_2.P$1 14.72,18.1 24.65,18.1 RJ_1.P$1
N$4
  Bottom 0.254: T5.2 R7.1
N$5
  Bottom 0.254: T6.2 R4.1
N$6
  Bottom 0.254: T7.2 R12.1
N$7
  Bottom 0.254: R6.2 6.03,10.48 JP1.1
N$10
  Bottom 0.406: IC1.7 28.48,40.55 27.94,40.01 26.8,40.01 Q1.2 26.67,38.1 27.62,37.15 C10.2
N$11
  Bottom 0.406: IC1.8 26.19,41.43 25.4,40.64 25.4,36.32 Q1.1 27.18,35.56 C11.2
N$13
  Bottom 0.406: IC1.20 30.08,51.03 31.11,52.07 C14.2
N$14
  Bottom 0.406: C16.1 28.02,52.47 L1.1 28.48,51.85 IC1.18
N$15
  Bottom 0.406: C18.2 20.71,55.24 IC7.1
N$18
  Bottom 0.406: C19.2 20.71,51.44 IC7.4
N$20
  Bottom 0.406: TDB-05.- 16.98,95.72 T1.3
N$22
  Top 0.61: 30.48,78.74 C3.+ | 30.48,78.74 30.48,76.2 27.94,73.66 IC3.10 | 30.48,78.74 30.57,78.83
  Top 0.813: F2-0.5A.2 35.47,80.01 30.48,80.01 C3.+
  pour Top (rank 2, no thermals): 32.38,80.64 29.84,80.64 29.21,80.01 29.21,78.11 26.67,75.56 26.67,72.39 27.3,71.75 31.11,71.75 31.75,72.39 31.75,76.2 33.02,77.47 33.02,80.01
N$32
  Bottom 0.406: IC8.8 C22.1 5.93,33.31 Q2.2
N$34
  Bottom 0.406: IC8.7 C23.1 5.93,28.92 Q2.1
N$35
  Bottom 0.406: C18.1 19.93,52.7 IC7.3
N$36
  Bottom 0.406: IC7.5 20.71,50.16 C19.1
N$37
  Bottom 0.406: IC7.2 17.78,53.98 16.75,55.01 C20.1
N$38
  Bottom 0.406: IC7.6 20.56,48.9 C21.1
N$63
  Top 0.61: SJ1.2 F2-0.5A.1
N$64
  Top 0.61: 20.32,71.12 IC3.12 | L3.1 20.32,71.12 | D3.C 21.93,79.08 20.32,77.47 20.32,71.12
  pour Top (rank 2, no thermals): 27.3,80.64 22.86,80.64 19.05,76.83 19.05,67.94 19.68,67.31 21.59,67.31 22.23,67.94 22.23,76.83 22.86,77.47 27.3,77.47 27.94,78.11 27.94,80.01
N$102
  Bottom 0.254: 36.51,86.19 R16.2
  Bottom 0.305: T5.1 36.51,86.19
N$104
  Bottom 0.254: T6.1 49.36,88.12 R17.2
N$106
  Bottom 0.254: 42.86,86.19 R15.2
  Bottom 0.305: T7.1 42.86,86.19
N$108
  Top 0.406: R18.1 LED4.A
PC  (1 unrouted)
  Top 0.813: IC2.5 44.43,64.79 43.18,66.04 38.1,66.04 36.58,67.56 SJ1.3
  Top 1.93: IC2.1 54.53,61.75 X7.L1
  Bottom 1.93: IC2.5 47.66,58.42 51.4,58.42 IC2.1
PRE12V
  Top 0.813: SJ1.1 44.45,69.85 46.35,71.75 D2.P$3
  Top 1.778: IC2.3 49.53,70.48 D2.P$3
RESET  (via drill 0.3)
  Top 0.254: SV3.5 11.43,40.64 11.43,25.4 12.7,24.13 v13.97,24.13
  Bottom 0.254: v13.97,24.13 IC8.17
RST
  Bottom 0.406: IC1.29 36.28,45.32 R1.1 36.83,44.13 C13.2
RXCAN
  Bottom 0.254: IC8.2 7.62,24.13 6.99,23.5 IC9.4
RXD  (via drill 0.3)
  Top 0.254: v31.11,45.09 27.94,48.26 16.51,48.26 v14.61,50.16
  Bottom 0.254: v31.11,45.09 31.68,44.52 IC1.30 | IC7.12 v14.61,50.16
SCK  (via drill 0.3)
  Top 0.254: SV3.3 13.97,40.64 v13.97,29.21
  Bottom 0.254: IC1.17 24.93,50.01 22.86,47.94 22.86,45.09 20.95,43.18 16.51,43.18 SV3.3 | v13.97,29.21 IC8.13
SPEAKER  (1 unrouted)
SW_GELB  (1 unrouted)
SW_GRUEN  (1 unrouted)
SW_ROT  (1 unrouted)
TXCAN
  Bottom 0.254: IC9.1 3.17,19.37 3.81,18.73 7.3,18.73 10.34,21.77 IC8.1
TXD  (via drill 0.3)
  Top 0.254: v14.61,47.62 27.3,47.62 v31.11,43.81
  Bottom 0.254: IC7.10 v14.61,47.62 | v31.11,43.81 31.21,43.72 IC1.31

### Text on the board
tPlace: PC3 | PC4 | PC5 | PD2 | PD3 | PD4 | ADC7 | ADC6 | PB1 | PD7 | PD6
bPlace: 24V
tNames: CN2013 | PowerSwitch-010
Document: Speaker